# Altium schematic sheet Wifi модуль.SchDoc
size 209 x 297 mm; Scale: 1:1; DocumentType: Схема электрическая принципиальная; FirstReferrence: АБВГ.123456.001
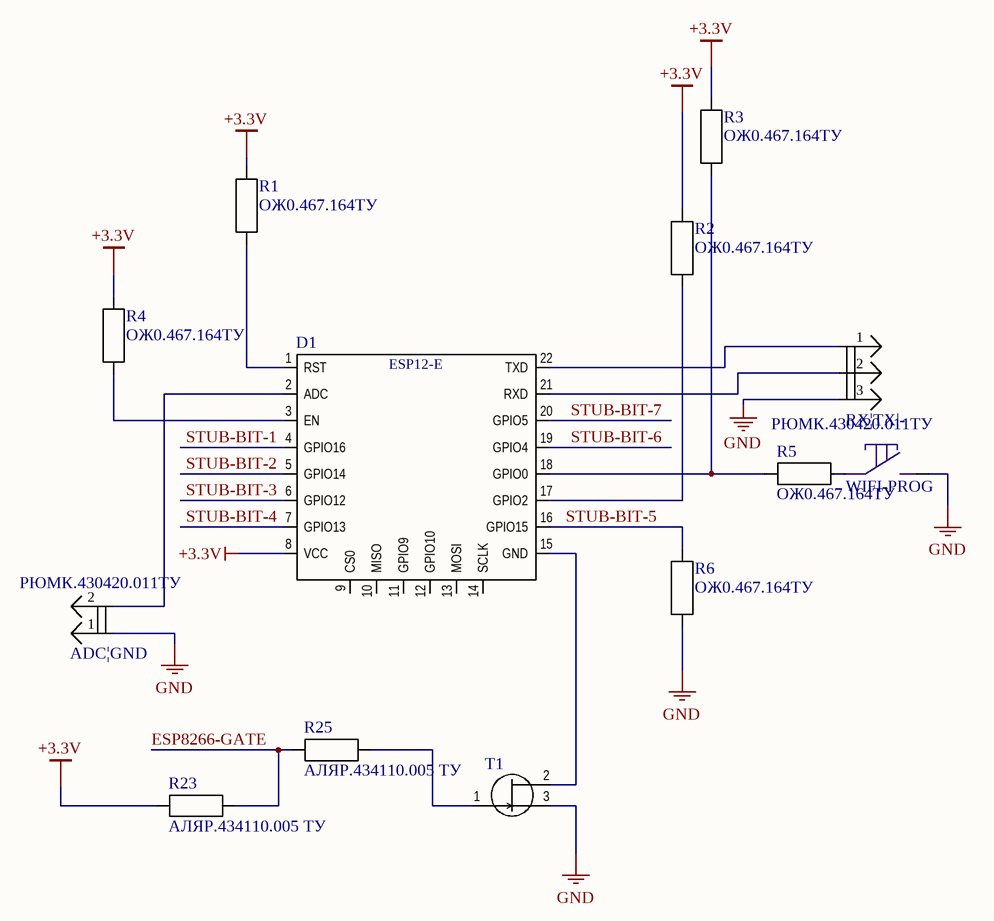
[diagram p0: Wifi модуль.SchDoc]

## Parts
ADC|GND  РЮМК.430420.011ТУ  [СНП346-2ВП21-1]
D1  (no value)  [ESP12-E]
R1  ОЖ0.467.164ТУ  [Р1-8МП-0,125]
R2  ОЖ0.467.164ТУ  [Р1-8МП-0,125]
R3  ОЖ0.467.164ТУ  [Р1-8МП-0,125]
R4  ОЖ0.467.164ТУ  [Р1-8МП-0,125]
R5  ОЖ0.467.164ТУ  [Р1-8МП-0,125]
R6  ОЖ0.467.164ТУ  [Р1-8МП-0,125]
R23  АЛЯР.434110.005 ТУ  [Р1-12-0,125]
R25  АЛЯР.434110.005 ТУ  [Р1-12-0,125]
RX|TX|-  РЮМК.430420.011ТУ  [СНП346-3ВП21-1]
T1  (no value)  [SOT23]
WIFI-PROG  Кнопка тактовая smd  [Кнопка тактовая smd]  (value not drawn)

## Nets
1: WIFI-PROG.2
3: WIFI-PROG.4
+3.3V: D1.8(VCC) R1.1 R2.2 R3.2 R4.1 R23.1
GND: ADC|GND.1 R6.1 RX|TX|-.3 T1.3 WIFI-PROG.3
ESP8266-GATE: R23.2 R25.1
STUB-BIT-1: D1.4(GPIO16)
STUB-BIT-2: D1.5(GPIO14)
STUB-BIT-3: D1.6(GPIO12)
STUB-BIT-4: D1.7(GPIO13)
STUB-BIT-5: D1.16(GPIO15) R6.2
STUB-BIT-6: D1.19(GPIO4)
STUB-BIT-7: D1.20(GPIO5)
NetADC|GND_2: ADC|GND.2 D1.2(ADC)
NetD1_1: D1.1(RST) R1.2
NetD1_3: D1.3(EN) R4.2
NetD1_15: D1.15(GND) T1.2
NetD1_17: D1.17(GPIO2) R2.1
NetD1_18: D1.18(GPIO0) R3.1 R5.1
NetD1_21: D1.21(RXD) RX|TX|-.2
NetD1_22: D1.22(TXD) RX|TX|-.1
NetR5_2: R5.2 WIFI-PROG.1
NetR25_2: R25.2 T1.1

Not connected (* = marked no-connect by the designer): D1 9(CS0) 10(MISO) 11(GPIO9) 12(GPIO10) 13(MOSI) 14(SCLK)

## Notes on the sheet
- Перв. примен.
- Справ. №
- Подп. и дата
- Инв. № дубл.
- Взам. инв. №
- Разраб.
- Изм.
- Лист
- № докум.
- Подп.
- Дата
- Лит.
- Масса
- Масштаб
- Пров.
- Т.контр.
- Листов
- Инв. № подл.
- Утв.
- Н.контр.
- 2.106-A4
- Копировал
- Формат А4

## Library data of the parts
ADC|GND = СНП346-2ВП21-1: ManufacturerPartNumber: Вилка СНП346-2ВП21-1; Category: Соединитель; PartNumber: РЮМК.430420.011ТУ
D1 = ESP12-E: Manufacturer: ESPRESSIF; ManufacturerPartNumber: ESP12E; Category: Модуль
R1 R2 R4 R6 = Р1-8МП-0,125-100 Ом±1%: ManufacturerPartNumber: Р1-8МП-0,125-100 Ом±1%-0,5-Л; Value: 1k; Tolerance: ±1%-0,5-Л; Power/Voltage: 0,125; Category: Резистор; PartNumber: ОЖ0.467.164ТУ
R3 = Р1-8МП-0,125-100 Ом±1%: ManufacturerPartNumber: Р1-8МП-0,125-100 Ом±1%-0,5-Л; Value: 6.2k; Tolerance: ±1%-0,5-Л; Power/Voltage: 0,125; Category: Резистор; PartNumber: ОЖ0.467.164ТУ
R5 = Р1-8МП-0,125-100 Ом±1%: ManufacturerPartNumber: Р1-8МП-0,125-100 Ом±1%-0,5-Л; Value: 360 Ом; Tolerance: ±1%-0,5-Л; Power/Voltage: 0,125; Category: Резистор; PartNumber: ОЖ0.467.164ТУ
R23 = Р1-12-0,125-1,5 кОм±1%: ManufacturerPartNumber: Р1-12-0,125-1,5 кОм±1%-Л; Value: 1 кОм; Tolerance: ±1%-Л; Power/Voltage: 0,125; Category: Резистор; PartNumber: АЛЯР.434110.005 ТУ
R25 = Р1-12-0,125-200 Ом±5%: ManufacturerPartNumber: Р1-12-0,125-200 Ом±5%-Л; Value: 360 Ом; Tolerance: ±5%-Л; Power/Voltage: 0,125; Category: Резистор; PartNumber: АЛЯР.434110.005 ТУ
RX|TX|- = СНП346-3ВП21-1: ManufacturerPartNumber: Вилка СНП346-3ВП21-1; Category: Соединитель; PartNumber: РЮМК.430420.011ТУ
T1 = IRLML2502: Manufacturer: International rectifier; Category: Транзистор; ManufacturerPartNumber: IRLML2502
WIFI-PROG = Кнопка тактовая smd: Category: Соединитель